# Altium schematic sheet 稳压电源.SchDoc
size A2
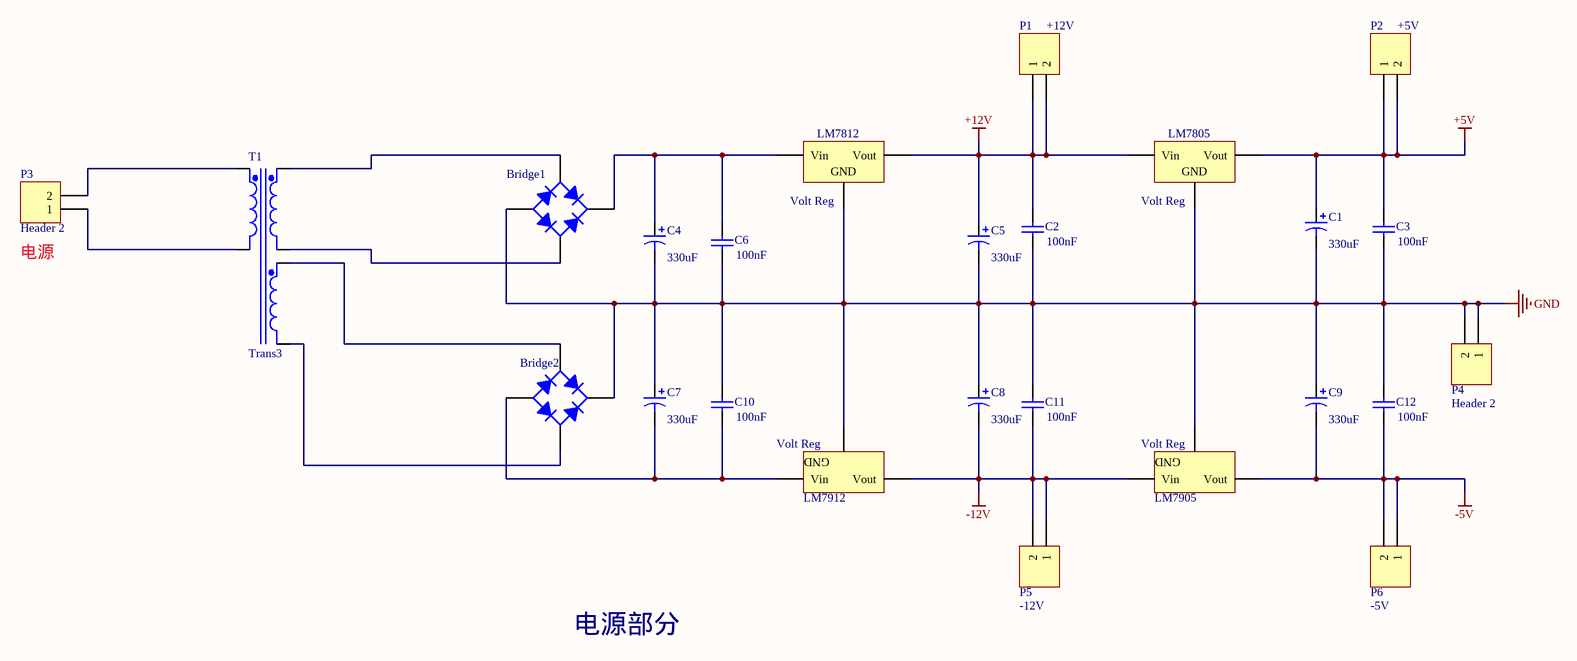
[diagram p0: 稳压电源.SchDoc]

## Parts
C1  value 330uF  [CAPPR2-5x6.8]  (hidden comment: Cap Pol1)
C2  value 100nF  [CAPR2.54-5.1x3.2]  (hidden comment: Cap)
C3  value 100nF  [CAPR2.54-5.1x3.2]  (hidden comment: Cap)
C4  value 330uF  [CAPPR2-5x6.8]  (hidden comment: Cap Pol1)
C5  value 330uF  [CAPPR2-5x6.8]  (hidden comment: Cap Pol1)
C6  value 100nF  [CAPR2.54-5.1x3.2]  (hidden comment: Cap)
C7  value 330uF  [CAPPR2-5x6.8]  (hidden comment: Cap Pol1)
C8  value 330uF  [CAPPR2-5x6.8]  (hidden comment: Cap Pol1)
C9  value 330uF  [CAPPR2-5x6.8]  (hidden comment: Cap Pol1)
C10  value 100nF  [CAPR2.54-5.1x3.2]  (hidden comment: Cap)
C11  value 100nF  [CAPR2.54-5.1x3.2]  (hidden comment: Cap)
C12  value 100nF  [CAPR2.54-5.1x3.2]  (hidden comment: Cap)
D1  Bridge1  [整流桥]
D2  Bridge2  [整流桥]
LM7805  Volt Reg  [TO254P1510-3_4N]
LM7812  Volt Reg  [TO254P1510-3_4N]
LM7905  Volt Reg  [TO254P1510-3_4N]
LM7912  Volt Reg  [TO254P1510-3_4N]
P1  +12V  [HDR1X2]
P2  +5V  [HDR1X2]
P3  Header 2  [HDR1X2]
P4  Header 2  [HDR1X2]
P5  -12V  [HDR1X2]
P6  -5V  [HDR1X2]
T1  Trans3  [TRF_6]

## Nets
+5V: C1.1 C3.2 LM7805.3(Vout) P2.1 P2.2
+12V: C2.2 C5.1 LM7805.1(Vin) LM7812.3(Vout) P1.1 P1.2
-5V: C9.2 C12.1 LM7905.3(Vout) P6.1 P6.2
-12V: C8.2 C11.1 LM7905.1(Vin) LM7912.3(Vout) P5.1 P5.2
GND: C1.2 C2.1 C3.1 C4.2 C5.2 C6.1 C7.1 C8.1 C9.1 C10.2 C11.2 C12.2 D1.3(A) D2.1(K) LM7805.2(GND) LM7812.2(GND) LM7905.2(GND) LM7912.2(GND) P4.1 P4.2
NetC4_1: C4.1 C6.2 D1.1(K) LM7812.1(Vin)
NetC7_2: C7.2 C10.1 D2.3(A) LM7912.1(Vin)
NetD1_2: D1.2(C) T1.4(Sec1-)
NetD1_4: D1.4(C) T1.3(Sec1+)
NetD2_2: D2.2(C) T1.6(Sec2-)
NetD2_4: D2.4(C) T1.5(Sec2+)
NetP3_1: P3.1 T1.2(Pri-)
NetP3_2: P3.2 T1.1(Pri+)

## Notes on the sheet
- (near P3) 电源
- 电源部分

## Library data of the parts
C1 C4 C5 C7-C9 = Cap Pol1: Polarized Capacitor (Radial); Published: 8-Jun-2000; LatestRevisionDate: 17-Jul-2002; LatestRevisionNote: Re-released for DXP Platform.; PackageReference: RB7.6-15; Publisher: Altium Limited
C2 C3 C6 C10-C12 = Cap: Capacitor; Published: 8-Jun-2000; LatestRevisionDate: 17-Jul-2002; LatestRevisionNote: Re-released for DXP Platform.; PackageReference: RAD-0.3; Publisher: Altium Limited
D1 D2 = Bridge1: Full Wave Diode Bridge; Published: 8-Jun-2000; LatestRevisionDate: 29-May-2009; LatestRevisionNote: Sch pins A & K swapped.; DatasheetVersion: E2732B; PackageReference: D-38; Publisher: Altium Limited; PackageDescription: Bridge Rectifier; 4 Terminals; Body 9.4 x 9.4 mm (typ); Pitch 5.08 mm
LM7805 LM7812 LM7905 LM7912 = Volt Reg: Voltage Regulator; Published: 24-Mar-1999; LatestRevisionDate: 29-May-2009; LatestRevisionNote: IPC-7351 Footprint Added.; PackageReference: D2PAK; Publisher: Altium Limited; PackageDescription: 3-Pin Transistor Outline Package 2.54 mm Pitch, 15.1 mm Lead Span
P1-P6 = Header 2: Header, 2-Pin; LatestRevisionDate: 17-Jul-2002; LatestRevisionNote: Re-released for DXP Platform.; Publisher: Altium Limited
T1 = Trans3: Three-winding Transformer (Non-Ideal); Sim Note: Enter the turns ratios, Core loss resistance, Magnetising Reactance, Leakage Reactances and Resistances referred to the primary side into the parameter fields.; Published: 25-Jan-2001; LatestRevisionDate: 17-Jul-2002; LatestRevisionNote: Re-released for DXP Platform.; PackageReference: TRF_6; Publisher: Altium Limited